# EAGLE schematic Wifi Circuit (EAGLE 9.6.2)
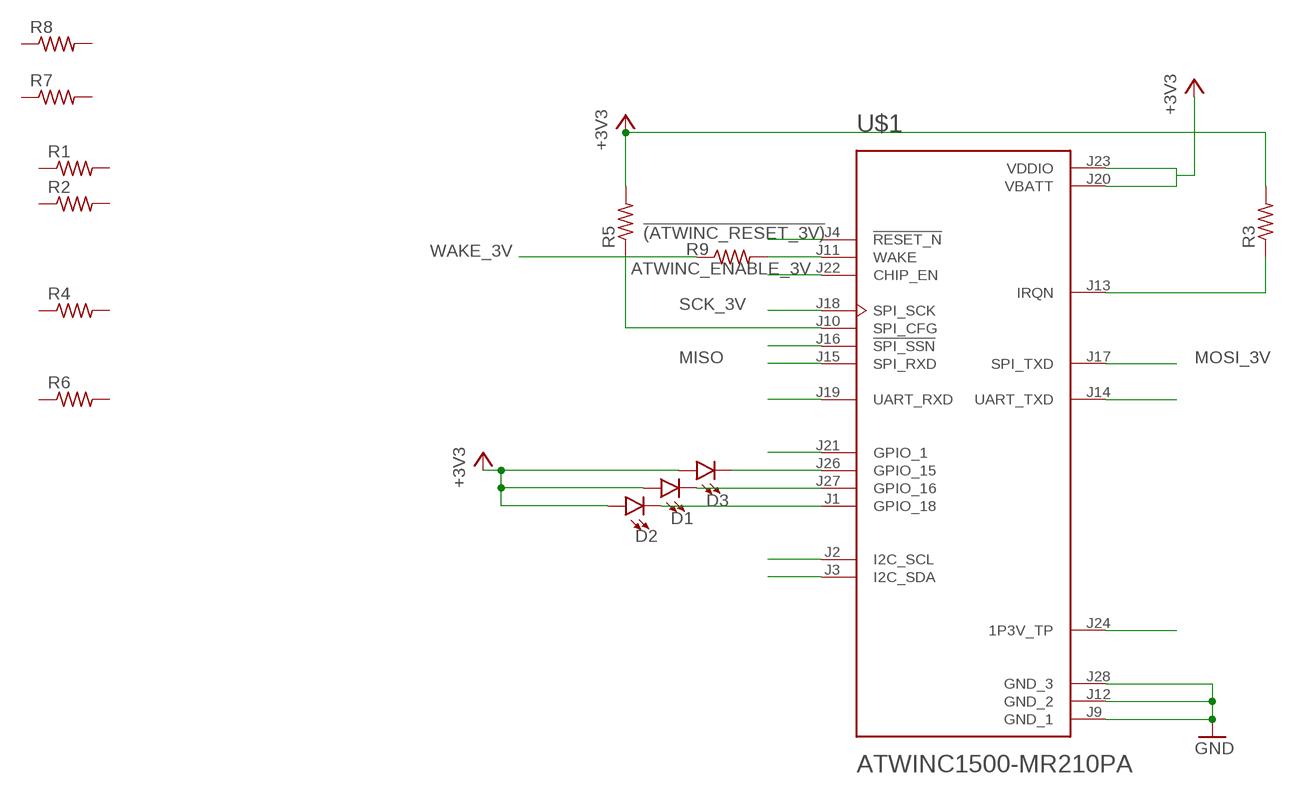
[diagram p0: schematic, sheet 1]

## Parts
D1  LED3MM  [LED_3MM]
D2  LED3MM  [LED_3MM]
D3  LED3MM  [LED_3MM]
R1  R-US_R0805  [R0805]
R2  R-US_R0805  [R0805]
R3  R-US_R0805  [R0805]
R4  R-US_R0805  [R0805]
R5  R-US_R0805  [R0805]
R6  R-US_R0805  [R0805]
R7  R-US_R0805  [R0805]
R8  R-US_R0805  [R0805]
R9  R-US_R0805  [R0805]
U$1  ATWINC1500-MR210PA  [ATMEL_ATWINC1500-MR210PA]

## Nets
!(ATWINC_RESET_3V): U$1.J4(!RESET_N)
+3V3: D1.A D2.A D3.A R3.2 R5.2 U$1.J20(VBATT) U$1.J23(VDDIO)
ATWINC_ENABLE_3V: U$1.J22(CHIP_EN)
D12: U$1.J3(I2C_SDA)
GND: U$1.J9(GND_1) U$1.J12(GND_2) U$1.J28(GND_3)
MISO: U$1.J15(SPI_RXD)
MOSI_3V: U$1.J17(SPI_TXD)
N$2: R9.2 U$1.J11(WAKE)
N$4: R5.1 U$1.J10(SPI_CFG)
N$5: R3.1 U$1.J13(IRQN)
N$6: U$1.J16(!SPI_SSN)
N$8: U$1.J19(UART_RXD)
N$9: U$1.J21(GPIO_1)
N$10: D3.K(C) U$1.J26(GPIO_15)
N$11: D1.K(C) U$1.J27(GPIO_16)
N$12: D2.K(C) U$1.J1(GPIO_18)
N$13: U$1.J2(I2C_SCL)
N$19: U$1.J14(UART_TXD)
N$20: U$1.J24(1P3V_TP)
SCK_3V: U$1.J18(SPI_SCK)
WAKE_3V: R9.1
Unconnected: R1.1 R1.2 R2.1 R2.2 R4.1 R4.2 R6.1 R6.2 R7.1 R7.2 R8.1 R8.2

## Library data of the parts
D1-D3 = SparkFun-LED:LED: LED (Generic) Standard schematic elements and footprints for 5mm, 3mm, 1206, and 0603 sized LEDs. Generic LEDs with no color specified.; PROD_ID: DIO-08794
R1-R9 = rcl:R-US_: RESISTOR, American symbol; SPICEPREFIX: R
U$1 = ATWINC1500-MR210PA:ATWINC1500-MR210PA: Certified Module with ATWINC1500A-Mu Chip and PCB Antenna Check prices <https://pricing.snapeda.com/parts/ATWINC1500-MR210PA/Microchip%20Technology/view-part?ref=eda>; AVAILABILITY: In Stock; DESCRIPTION: WiFi 802.11b/g/n Transceiver Module 2.4GHz Integrated, Trace Surface Mount; MF: Microchip Technology; MP: ATWINC1500-MR210PA; PACKAGE: None; PRICE: None